# Altium schematic sheet P04_ USB.SchDoc
size A4; SheetNumber: 4; SheetTotal: 7
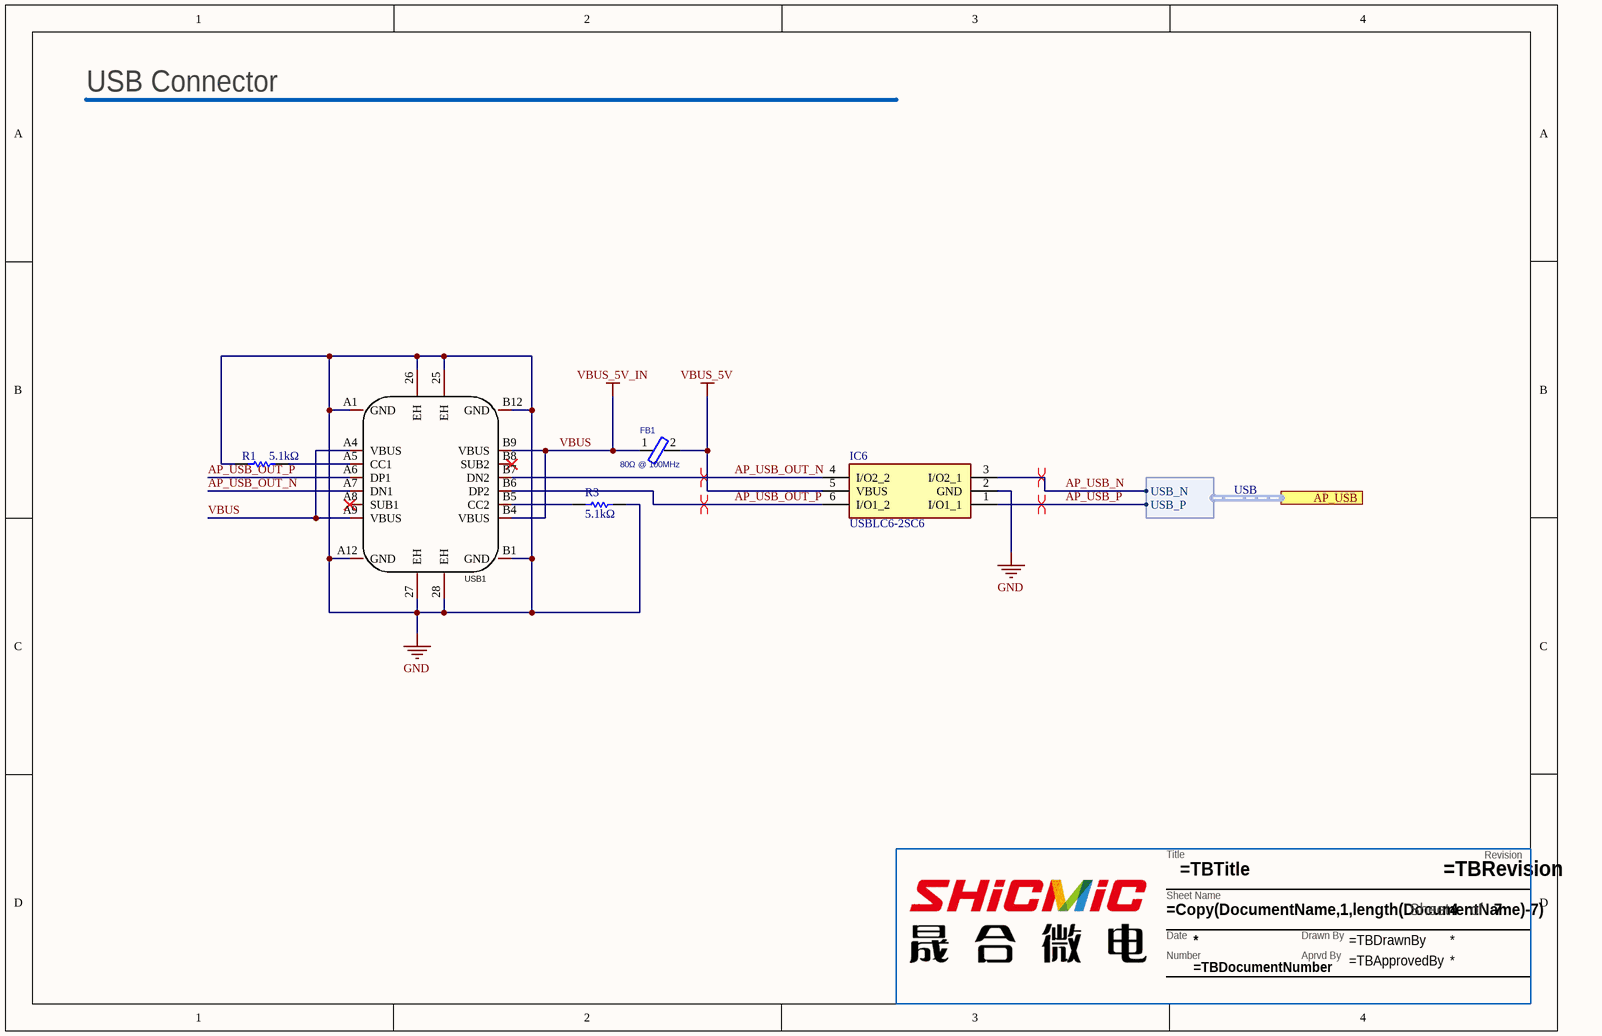
[diagram p0: P04_ USB.SchDoc]

## Parts
?  TitleBlock  (value not drawn)  (graphical)
FB1  80Ω @ 100MHz  [IPC_A]
IC6  USBLC6-2SC6  [SOT95P280X145-6N]
R1  5.1kΩ  [RES_0402]
R3  5.1kΩ  [RES_0402]
USB1  TYPE-C 16P CB1.6 073  [USB-C-SMD_SHOU_TYPE-C-16P-CB1.6]  (value not drawn)

## Ports
AP_USB (harness USB)

## Harnesses
USB: USB_N, USB_P

## Nets
GND: IC6.2(GND) R1.1 R3.2 USB1.25(EH) USB1.26(EH) USB1.27(EH) USB1.28(EH) USB1.A1(GND) USB1.A12(GND) USB1.B1(GND) USB1.B12(GND)
VBUS: FB1.1 USB1.A4(VBUS) USB1.A9(VBUS) USB1.B4(VBUS) USB1.B9(VBUS)  [also labelled VBUS_5V_IN]
VBUS_5V: FB1.2 IC6.5(VBUS)
AP_USB_N: IC6.3(I/O2_1) ; port AP_USB.USB_N
AP_USB_OUT_N: IC6.4(I/O2_2) USB1.A7(DN1) USB1.B7(DN2)
AP_USB_OUT_P: IC6.6(I/O1_2) USB1.A6(DP1) USB1.B6(DP2)
AP_USB_P: IC6.1(I/O1_1) ; port AP_USB.USB_P
NetR1_2: R1.2 USB1.A5(CC1)
NetR3_1: R3.1 USB1.B5(CC2)

Not connected (* = marked no-connect by the designer): USB1 A8(SUB1)* B8(SUB2)*

## Layout directives
differential pair: AP_USB_N, AP_USB_OUT_N, AP_USB_OUT_P, AP_USB_P

## Notes on the sheet
- USB Connector
- (in symbol TitleBlock) Revision; Title; Sheet Name; Sheet; of; Date; Drawn By; Number; Aprvd By

## Library data of the parts
? = TitleBlock: Title block for Ambiq Schematics. Please have the following parameters entered in Project>Project Options>Parameters: / TBTitle / TBDocumentNumber / TBRevision / TBDrawnBy / TBApprovedBy; AMBIQ PN: TitleBlock
FB1 = Ferrite: NONE; Manufacturer: Taiyo Yuden; AMBIQ PN: FBMJ3216HS800-T; Impedance: 80R; Tolerance: 25%; DC Resistance (DCR): 10mR; Max DC Current: 4A; Number of Lines: 1; Shielding: Unshielded; Supplier 1: Newark; Supplier Part Number 1: 86H5353; Manufacturer Part Number: FBMJ3216HS800-T; RoHS: Yes; Category: Ferrite Beads and Chips; Stock 1: 265; Pricing 1: 1=0.30000, 10=0.20700, 25=0.17700, 50=0.14800, 100=0.11800 (USD); ComponentLink1URL: https://datasheet.ciiva.com/5709/chipbeads01-e-5709344.pdf?src-supplier=Farnell; ComponentLink1Description: https://datasheet.ciiva.com/5709/chipbeads01-e-5709344.pdf?src-supplier=Farnell; Mount: Surface Mount; Case/Package: 1206; Number of Pins: 2; Core Material: Ferrite; Case Code (Metric): 3216; Case Code (Imperial): 1206; Material: Ferrite; Min Operating Temperature: -40°C; Max Operating Temperature: 125°C; Packaging: Tape and Reel; Resistance: 10mR; Package Quantity: 1; Max Current Rating: 4A; Termination: SMD/SMT; Test Frequency: 100MHz; Frequency: 100MHz; Series: FB; Resistor Type: Ferrite Bead; Length: 3.2mm; Width: 0.063inch; Height: 1.3mm; Depth: 1.8mm; Lead Free: Lead Free; Halogen Free: Halogen Free; REACH SVHC: No SVHC; ComponentLink2URL: https://datasheet.ciiva.com/16001/202fbmj3216hs800-t-16001070.pdf?src-supplier=Onlinecomponents.com; ComponentLink2Description: https://datasheet.ciiva.com/16001/202fbmj3216hs800-t-16001070.pdf?src-supplier=Onlinecomponents.com; ComponentLink3URL: https://datasheet.ciiva.com/30088/23fbmj3216hs800-t-30088710.pdf?src-supplier=Onlinecomponents.com; ComponentLink3Description: https://datasheet.ciiva.com/30088/23fbmj3216hs800-t-30088710.pdf?src-supplier=Onlinecomponents.com; ComponentLink4URL: https://datasheet.ciiva.com/23606/fbmj3216hs800-t-ss-23606768.pdf?src-supplier=Newark; ComponentLink4Description: https://datasheet.ciiva.com/23606/fbmj3216hs800-t-ss-23606768.pdf?src-supplier=Newark; ComponentLink5URL: https://datasheet.ciiva.com/25614/0900766b810b37be-25614395.pdf?src-supplier=RSComponents; ComponentLink5Description: https://datasheet.ciiva.com/25614/0900766b810b37be-25614395.pdf?src-supplier=RSComponents; ComponentLink6URL: https://datasheet.ciiva.com/6212/chipbeads01-e-6212909.pdf?src-supplier=Digi-Key; ComponentLink6Description: https://datasheet.ciiva.com/6212/chipbeads01-e-6212909.pdf?src-supplier=Digi-Key; ComponentLink7URL: https://datasheet.ciiva.com/7966/chipbeads01-e-7966171.pdf?src-supplier=Element14; ComponentLink7Description: https://datasheet.ciiva.com/7966/chipbeads01-e-7966171.pdf?src-supplier=Element14
IC6 = USBLC6-2SC6: Integrated Circuit; Manufacturer_Name: STMicroelectronics; Datasheet Link: http://www.st.com/st-web-ui/static/active/en/resource/technical/document/datasheet/CD00050750.pdf; Height: 1.45mm; Manufacturer_Part_Number: USBLC6-2SC6; Mouser Part Number: 511-USBLC6-2SC6; Mouser Price/Stock: https://www.mouser.co.uk/ProductDetail/STMicroelectronics/USBLC6-2SC6?qs=po45yt2pPpu%2FhNIlwQdTlg%3D%3D; Arrow Part Number: USBLC6-2SC6; Arrow Price/Stock: https://www.arrow.com/en/products/usblc6-2sc6/stmicroelectronics?region=nac
R1 R3 = Resistor: Res Thick Film 0402 20K Ohm 1% 1/16W ±100ppm/°C Molded SMD Paper T/R; Manufacturer: Vishay; AMBIQ PN: CRCW040220K0FKED; Resistance: 20kR; Power Rating: 63mW; Voltage Rating: 50V; Supplier 1: Newark; Supplier Part Number 1: 24W2083; Manufacturer Part Number: CRCW040220K0FKED; RoHS: Yes; Category: Chip SMD Resistors; Stock 1: 380000; Pricing 1: 1=0.00600, 10000=0.00600 (USD); Mount: Surface Mount; Case/Package: 0402; Weight: 2.3E-05oz; Case Code (Metric): 1005; Case Code (Imperial): 0402; Contact Plating: Tin; Min Operating Temperature: -55°C; Max Operating Temperature: 155°C; Package Quantity: 10; Packaging: Tape and Reel; Resistor Type: Thick Film; Number of Terminations: 2; Termination: SMD/SMT; Max Power Dissipation: 63mW; Temperature Coefficient: 100ppm/°C; Voltage Rating (DC): 50V; Features: Automotive AEC-Q200; Series: CRCW; Technology: THICK FILM; Construction: Rectangular; Length: 1mm; Width: 0.5mm; Height: 0.35mm; Depth: 0.5mm; Radiation Hardening: No; REACH SVHC: Unknown; Military Standard: Not; Lead Free: Lead Free; RoHS Compliant: Yes; ComponentLink1URL: https://datasheet.ciiva.com/11810/0900766b80d98824-11810023.pdf?src-supplier=RSComponents; ComponentLink1Description: https://datasheet.ciiva.com/11810/0900766b80d98824-11810023.pdf?src-supplier=RSComponents; ComponentLink2URL: https://datasheet.ciiva.com/2463/dcrcwe3-2463139.pdf?src-supplier=Digi-Key; ComponentLink2Description: https://datasheet.ciiva.com/2463/dcrcwe3-2463139.pdf?src-supplier=Digi-Key; ComponentLink3URL: https://datasheet.ciiva.com/2463/dcrcwe3-2463140.pdf?src-supplier=Digi-Key; Tolerance: 1%; Number of Pins: 2; Resistance Tolerance: 1%; Working Voltage: 50V
USB1 = TYPE-C 16P CB1.6 073: Manufacturer: SHOU HAN(首韩); Add into BOM: yes; Gender: 母; Number of Ports: 1; Current Rating - Power (Max): 3A; Name: TYPE-C 16P CB1.6 073; Symbol: TYPE-C 16P CB1.6 073; Device: TYPE-C 16P CB1.6 073; LCSC Part Name: Type-C 母 沉板; Supplier Part: C2906290; Manufacturer Part: TYPE-C 16P CB1.6 073; Supplier Footprint: SMD; JLCPCB Part Class: Extended Part; Datasheet: https://atta.szlcsc.com/upload/public/pdf/source/20211021/35D048B933FA988260DD32545575C1A5.pdf; Supplier: LCSC; Convert to PCB: yes; Connector Type: Type-C; Standard: -; Number of Contacts: 16P; Mounting Style: 沉板; Operating Temperature Range: -25℃~+85℃